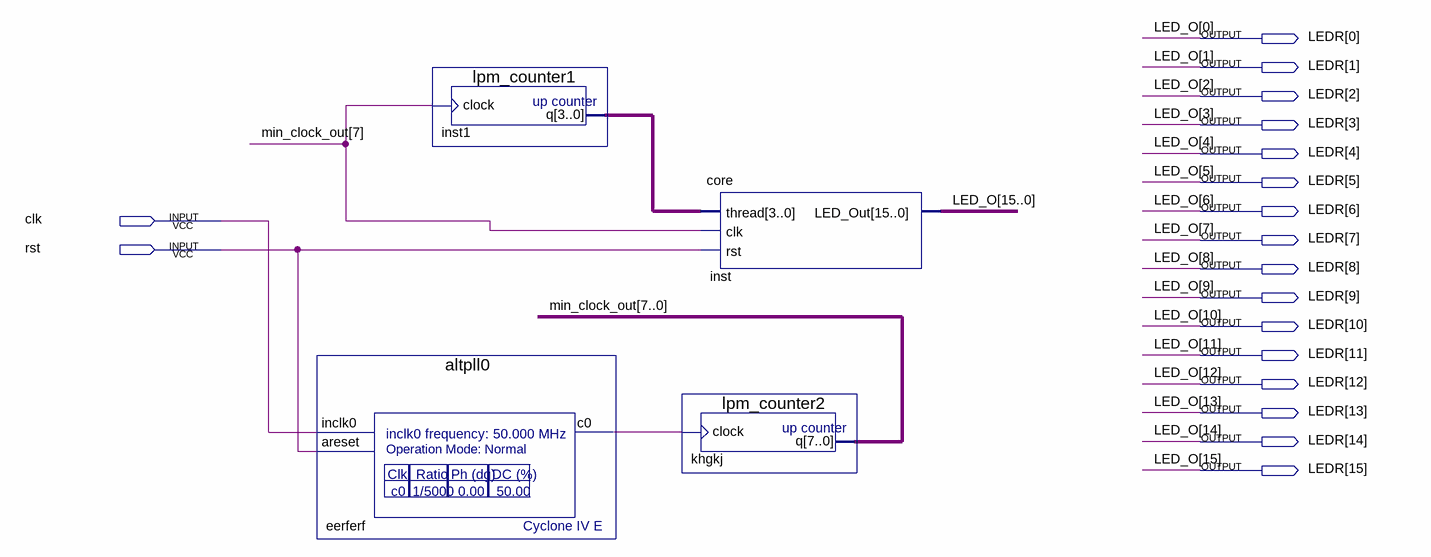
[diagram p0: schematic sheet]
// Quartus schematic coreTest.bdf as structural Verilog: 4 symbols, 18 pins
module coreTest (
  input  clk,
  input  rst,
  output [15:0] LEDR
);

  wire eerferf_c0;
  wire [3:0] inst1_q;
  wire [7:0] min_clock_out;

  altpll0 eerferf (.inclk0(clk), .areset(rst), .c0(eerferf_c0));
  lpm_counter1 inst1 (.clock(min_clock_out[7]), .q(inst1_q));
  core inst (.thread(inst1_q), .clk(min_clock_out[7]), .rst(rst), .LED_Out(LEDR));
  lpm_counter2 khgkj (.clock(eerferf_c0), .q(min_clock_out));

  // Other names for the same wires on the sheet: LED_O[15:0] = LEDR
endmodule
